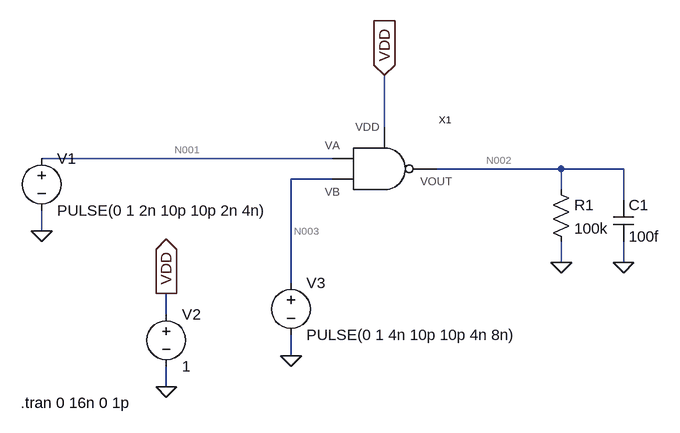
[diagram p0: schematic nandtest.asc]
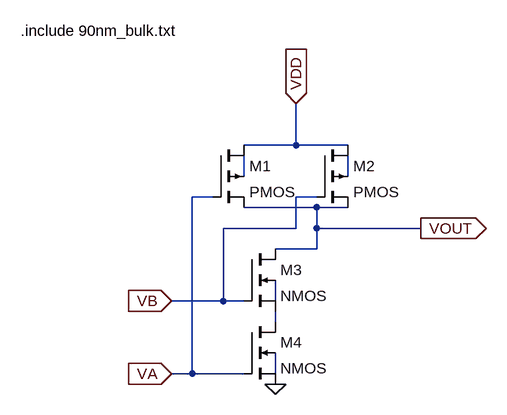
[diagram p1: sub-circuit nand.asc]
nandtest.asc, the LTspice schematic file:
Version 4
SHEET 1 880 680
WIRE 240 64 240 -16
WIRE 160 112 -288 112
WIRE 512 128 320 128
WIRE 608 128 512 128
WIRE 160 144 96 144
WIRE 512 160 512 128
WIRE 608 176 608 128
WIRE -288 224 -288 192
WIRE 512 272 512 240
WIRE 608 272 608 240
WIRE 96 304 96 144
WIRE -96 352 -96 320
WIRE 96 416 96 384
WIRE -96 464 -96 432
FLAG 240 -16 VDD
IOPIN 240 -16 In
FLAG -288 224 0
FLAG 96 416 0
FLAG -96 464 0
FLAG -96 320 VDD
IOPIN -96 320 Out
FLAG 608 272 0
FLAG 512 272 0
SYMBOL nand 224 112 R0
SYMATTR InstName X1
SYMBOL voltage -288 96 R0
WINDOW 123 0 0 Left 0
WINDOW 39 0 0 Left 0
SYMATTR InstName V1
SYMATTR Value PULSE(0 1 2n 10p 10p 2n 4n)
SYMBOL voltage -96 336 R0
WINDOW 123 0 0 Left 0
WINDOW 39 0 0 Left 0
SYMATTR InstName V2
SYMATTR Value 1
SYMBOL voltage 96 288 R0
WINDOW 123 0 0 Left 0
WINDOW 39 0 0 Left 0
SYMATTR InstName V3
SYMATTR Value PULSE(0 1 4n 10p 10p 4n 8n)
SYMBOL cap 592 176 R0
SYMATTR InstName C1
SYMATTR Value 100f
SYMBOL res 496 144 R0
SYMATTR InstName R1
SYMATTR Value 100k
TEXT -320 488 Left 2 !.tran 0 16n 0 1p

nand.asc, the sub-circuit schematic file:
Version 4
SHEET 1 880 696
WIRE 496 272 496 208
WIRE 496 272 416 272
WIRE 576 272 496 272
WIRE 416 320 416 288
WIRE 576 320 576 288
WIRE 368 352 336 352
WIRE 528 352 496 352
WIRE 528 368 416 368
WIRE 576 368 528 368
WIRE 496 400 496 352
WIRE 496 400 384 400
WIRE 528 400 528 368
WIRE 688 400 528 400
WIRE 528 432 528 400
WIRE 528 432 464 432
WIRE 384 512 384 400
WIRE 384 512 304 512
WIRE 416 512 384 512
WIRE 464 512 464 480
WIRE 464 544 464 528
WIRE 336 624 336 352
WIRE 336 624 304 624
WIRE 416 624 336 624
WIRE 464 624 464 592
FLAG 304 624 VA
IOPIN 304 624 In
FLAG 304 512 VB
IOPIN 304 512 In
FLAG 496 208 VDD
IOPIN 496 208 In
FLAG 688 400 VOUT
IOPIN 688 400 Out
FLAG 464 640 0
SYMBOL nmos4 416 432 R0
SYMATTR InstName M3
SYMATTR Value2 l=90n w=200n
SYMBOL nmos4 416 544 R0
SYMATTR InstName M4
SYMATTR Value2 l=90n w=200n
SYMBOL pmos4 368 272 R0
SYMATTR InstName M1
SYMATTR Value2 l=90n w=400n
SYMBOL pmos4 528 272 R0
SYMATTR InstName M2
SYMATTR Value2 l=90n w=400n
TEXT 72 96 Left 2 !.include 90nm_bulk.txt

The netlist it stands for:
* nandtest.asc
XX1 N001 N003 VDD N002 nand
V1 N001 0 PULSE(0 1 2n 10p 10p 2n 4n)
V2 VDD 0 1
V3 N003 0 PULSE(0 1 4n 10p 10p 4n 8n)
C1 N002 0 100f
R1 N002 0 100k

* block symbol definitions
.subckt nand VA VB VDD VOUT
M3 VOUT VB N004 N003 NMOS l=90n w=200n
M4 N004 VA 0 N005 NMOS l=90n w=200n
M1 VDD VA VOUT N001 PMOS l=90n w=400n
M2 VDD VB VOUT N002 PMOS l=90n w=400n
.include 90nm_bulk.txt
.ends nand

.model NMOS NMOS
.model PMOS PMOS
.lib standard.mos
.tran 0 16n 0 1p
.backanno
.end

* Results of the author's LTspice run, read from the files saved beside the schematic
* Operating Point, zero values left out:
*   V(n002) = 986.8 mV
*   V(vdd) = 1 V
*   I(R1) = 9.868 µA
*   I(V1) = 2.876 pA
*   I(V2) = -9.869 µA
*   I(V3) = 120.7 pA
*   Ix(x1:VA) = -2.876 pA
*   Ix(x1:VB) = -120.7 pA
*   Ix(x1:VDD) = 9.869 µA
*   Ix(x1:VOUT) = -9.868 µA
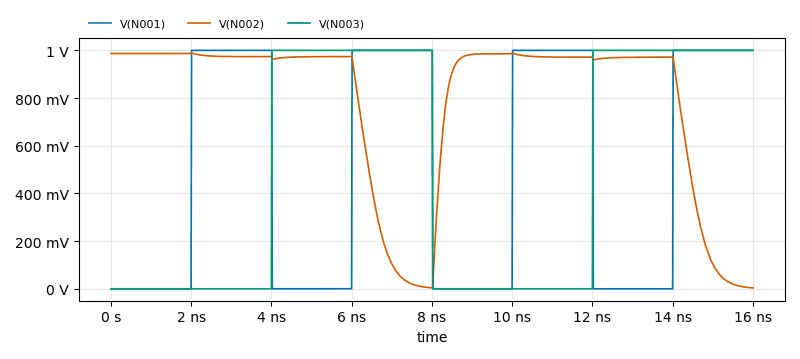
[diagram p2: Transient Analysis of nandtest.asc, plotted from the saved traces]
* Transient Analysis, 1 run:
*   V(N001): min 0 V, max 1 V, average 501.6 mV, rms 707.7 mV, last 1 V
*   V(N002): min 1.849 mV, max 989.4 mV, average 781.1 mV, rms 856.3 mV, last 3.777 mV
*   V(N003): min 0 V, max 1 V, average 500.3 mV, rms 707.1 mV, last 1 V